# Altium project Motor Driver.PrjPcb
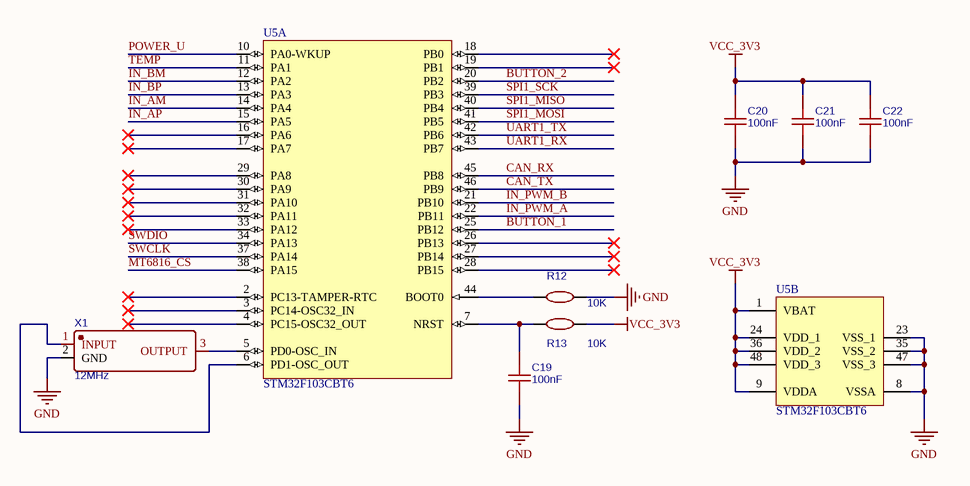
[diagram p0: MCU.SchDoc]
2 sheets, 18 parts. Net scope: global (net labels, ports and power ports of the same name join across sheets).
Board file: Motor Driver.PcbDoc
Sheets:
  MCU.SchDoc
  Port.SchDoc

## Sheet MCU.SchDoc
size 228 x 127 mm; SheetNumber: 3; SheetTotal: 5

### Parts
C19  100nF  [C0603]
C20  100nF  [C0603]
C21  100nF  [C0603]
C22  100nF  [C0603]
R12  10K  [R0603]
R13  10K  [R0603]
U5  STM32F103CBT6  [STM-LQFP48_L]  (parts A,B of 2)
X1  12MHz  [CRYSTAL-SMD_3P-L3.2-W1.3-P1.2-BL]

### Nets
GND: C19.1 C20.1 C21.1 C22.1 R12.2 U5.8(VSSA) U5.23(VSS_1) U5.35(VSS_2) U5.47(VSS_3) X1.2(GND)
VCC_3V3: C20.2 C21.2 C22.2 R13.2 U5.1(VBAT) U5.9(VDDA) U5.24(VDD_1) U5.36(VDD_2) U5.48(VDD_3)
BUTTON_1: U5.25(PB12)
BUTTON_2: U5.20(PB2)
CAN_RX: U5.45(PB8)
CAN_TX: U5.46(PB9)
IN_AM: U5.14(PA4)
IN_AP: U5.15(PA5)
IN_BM: U5.12(PA2)
IN_BP: U5.13(PA3)
IN_PWM_A: U5.22(PB11)
IN_PWM_B: U5.21(PB10)
MT6816_CS: U5.38(PA15)
POWER_U: U5.10(PA0-WKUP)
SPI1_MISO: U5.40(PB4)
SPI1_MOSI: U5.41(PB5)
SPI1_SCK: U5.39(PB3)
SWCLK: U5.37(PA14)
SWDIO: U5.34(PA13)
TEMP: U5.11(PA1)
UART1_RX: U5.43(PB7)
UART1_TX: U5.42(PB6)
NetC19_2: C19.2 R13.1 U5.7(NRST)
NetR12_1: R12.1 U5.44(BOOT0)
NetU5_5: U5.5(PD0-OSC_IN) X1.3(OUTPUT)
NetU5_6: U5.6(PD1-OSC_OUT) X1.1(INPUT)

Not connected (* = marked no-connect by the designer): U5 2(PC13-TAMPER-RTC)* 3(PC14-OSC32_IN)* 4(PC15-OSC32_OUT)* 16(PA6)* 17(PA7)* 18(PB0)* 19(PB1)* 26(PB13)* 27(PB14)* 28(PB15)* 29(PA8)* 30(PA9)* 31(PA10)* 32(PA11)* 33(PA12)*

### Library data of the parts
C19-C22 = 100nF: BOM_Manufacturer: SAMSUNG; BOM_Manufacturer Part: CL10B104KB8NNNC; nameAlias: Capacitance; BOM_Supplier: LCSC; BOM_Supplier Part: C1591; BOM_JLCPCB Part Class: Extended Part; spicePre: C; spiceSymbolName: CL10B104KB8NNNC
R12 R13 = 10K: BOM_Manufacturer: UniOhm; BOM_Manufacturer Part: 0603WAF1002T5E; nameAlias: Resistance (Ohms); BOM_Supplier: LCSC; BOM_Supplier Part: C25804; BOM_JLCPCB Part Class: Basic Part; spicePre: R; spiceSymbolName: 0603WAF1002T5E
U5 = CMP-0237-00250-3: ARM Cortex-M3 32-bit MCU, 128 KB Flash, 20 KB Internal RAM, 37 I/Os, 48-pin LQFP, -40 to 85 degC, Tray; Supply Voltage(Vcc) min (V): 2; Operating Frequency(F) (Processor speed) (MHz): 72; A/D Converter: 2x12-bit (10 Channel); FLASH Size (Prog) (kB): 128; Internal RAM Size (kB): 20; I/Os (High Current): 37; ComponentLink2Description: Datasheet; PackageReference: LQFP48; PartNumber: STM32F103CBT6; ComponentLink1Description: Manufacturer URL; DatasheetVersion: Rev. 16; PackageVersion: Rev. 6, 06/2013; Packing: Tray; ComponentLink1URL: http://www.st.com/web/en/home.html; Mounting Technology: Surface Mount; ComponentLink3URL: http://www.st.com/st-web-ui/static/active/en/resource/technical/document/datasheet/DM00058181.pdf; PackageDescription: 48-Pin Low Profile Quad Flat Package, 7 x 7 mm Body, 0.5 mm Pitch; Core: ARM Cortex-M3; ComponentLink3Description: Package Specification; ComponentLink2URL: http://www.st.com/st-web-ui/static/active/en/resource/technical/document/datasheet/CD00161566.pdf
X1 = 12MHz: BOM_Manufacturer: muRata(村田); BOM_Manufacturer Part: CSTNE12M0G52A000R0; nameAlias: Frequency; Contributor: LCSC; BOM_Supplier: LCSC; BOM_Supplier Part: C907957; BOM_JLCPCB Part Class: Extended Part; spicePre: X; spiceSymbolName: CSTNE12M0G52A000R0

## Sheet Port.SchDoc
size 127 x 177 mm; SheetNumber: 4; SheetTotal: 5
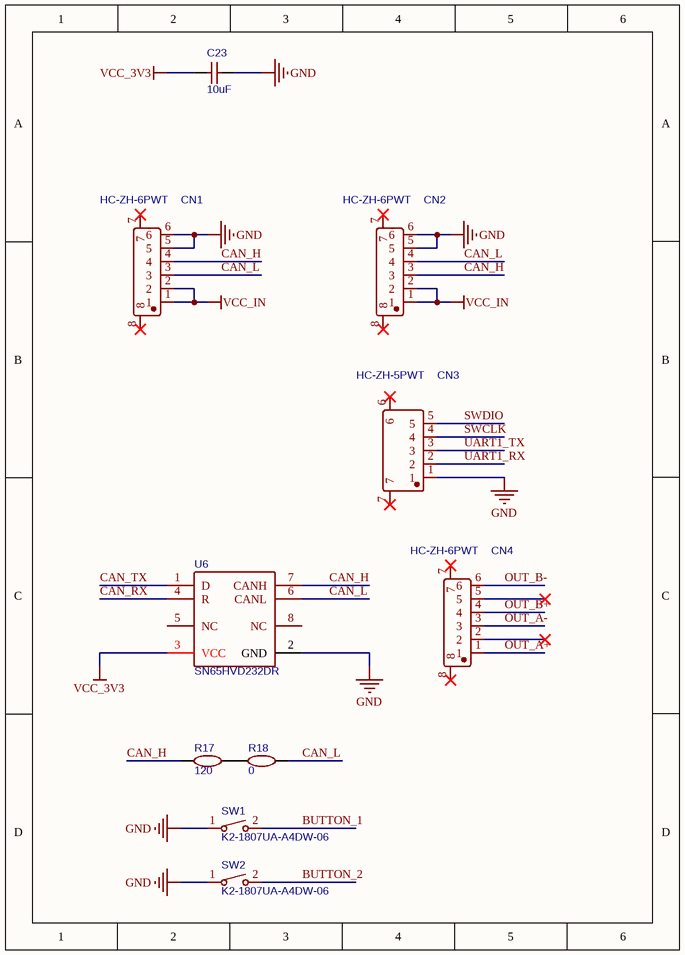
[diagram p1: Port.SchDoc]

### Parts
C23  10uF  [C1206]
CN1  HC-ZH-6PWT  [CONN-SMD_6P-P1.50_HCTL_HC-ZH-6PWT]
CN2  HC-ZH-6PWT  [CONN-SMD_6P-P1.50_HCTL_HC-ZH-6PWT]
CN3  HC-ZH-5PWT  [CONN-SMD_5P-P1.50_HCTL_HC-ZH-5PWT]
CN4  HC-ZH-6PWT  [CONN-SMD_6P-P1.50_HCTL_HC-ZH-6PWT]
R17  120  [R0603]
R18  0  [R0805]
SW1  K2-1807UA-A4DW-06  [KEY-SMD_L4.0-W2.9-L]
SW2  K2-1807UA-A4DW-06  [KEY-SMD_L4.0-W2.9-L]
U6  SN65HVD232DR  [SOIC-8_L5.0-W4.0-P1.27-LS6.0-BL]

### Nets
GND: C23.2 CN1.5 CN1.6 CN2.5 CN2.6 CN3.1 SW1.1 SW2.1 U6.2(GND)
VCC_3V3: C23.1 U6.3(VCC)
VCC_IN: CN1.1 CN1.2 CN2.1 CN2.2
BUTTON_1: SW1.2
BUTTON_2: SW2.2
CAN_H: CN1.4 CN2.3 R17.1 U6.7(CANH)
CAN_L: CN1.3 CN2.4 R18.2 U6.6(CANL)
CAN_RX: U6.4(R)
CAN_TX: U6.1(D)
OUT_A+: CN4.1
OUT_A-: CN4.3
OUT_B+: CN4.4
OUT_B-: CN4.6
SWCLK: CN3.4
SWDIO: CN3.5
UART1_RX: CN3.2
UART1_TX: CN3.3
NetR17_2: R17.2 R18.1

Not connected (* = marked no-connect by the designer): CN1 7* 8*; CN2 7* 8*; CN3 6* 7*; CN4 2* 5* 7* 8*; U6 5(NC) 8(NC)

### Library data of the parts
C23 = 10uF: BOM_Manufacturer Part: CL31A106KBHNNNE; BOM_Manufacturer: SAMSUNG; nameAlias: Capacitance; BOM_Supplier: LCSC; BOM_Supplier Part: C13585; BOM_JLCPCB Part Class: Basic Part; spicePre: C; spiceSymbolName: CL31A106KBHNNNE
CN1 CN2 CN4 = HC-ZH-6PWT: BOM_Manufacturer: HCTL(华灿天禄); Contributor: LCSC; BOM_Supplier: LCSC; BOM_Supplier Part: C2845428; BOM_Manufacturer Part: HC-ZH-6PWT; spicePre: C; spiceSymbolName: HC-ZH-6PWT
CN3 = HC-ZH-5PWT: BOM_Manufacturer: HCTL(华灿天禄); Contributor: LCSC; BOM_Supplier: LCSC; BOM_Supplier Part: C2845427; BOM_Manufacturer Part: HC-ZH-5PWT; spicePre: C; spiceSymbolName: HC-ZH-5PWT
R17 = 120: BOM_Manufacturer: UniOhm; BOM_Manufacturer Part: 0603WAF1200T5E; nameAlias: Resistance (Ohms); BOM_Supplier: LCSC; BOM_Supplier Part: C22787; BOM_JLCPCB Part Class: Basic Part; spicePre: R; spiceSymbolName: 0603WAF1200T5E
R18 = 0: BOM_Manufacturer: WTC; BOM_Manufacturer Part: WR08X000PTL; nameAlias: Resistance (Ohms); BOM_Supplier: LCSC; BOM_Supplier Part: C112378; BOM_JLCPCB Part Class: Extended Part; spicePre: R; spiceSymbolName: WR08X000PTL
SW1 SW2 = K2-1807UA-A4DW-06: BOM_Manufacturer: Korean Hroparts Elec; Contributor: LCSC; BOM_Supplier: LCSC; BOM_Supplier Part: C502307; BOM_Manufacturer Part: K2-1807UA-A4DW-06; BOM_JLCPCB Part Class: Extended Part; spicePre: S; spiceSymbolName: K2-1807UA-A4DW-06
U6 = SN65HVD232DR: BOM_Manufacturer: TI; BOM_Supplier: LCSC; BOM_Manufacturer Part: SN65HVD232DR; BOM_Supplier Part: C30530; BOM_JLCPCB Part Class: Extended Part; spicePre: U; spiceSymbolName: SN65HVD232DR

## Nets that join several sheets
GND: MCU (10 pins), Port (9 pins)
VCC_3V3: MCU (9 pins), Port (C23.1 U6.3)
BUTTON_1: MCU (U5.25), Port (SW1.2)
BUTTON_2: MCU (U5.20), Port (SW2.2)
CAN_RX: MCU (U5.45), Port (U6.4)
CAN_TX: MCU (U5.46), Port (U6.1)
SWCLK: MCU (U5.37), Port (CN3.4)
SWDIO: MCU (U5.34), Port (CN3.5)
UART1_RX: MCU (U5.43), Port (CN3.2)
UART1_TX: MCU (U5.42), Port (CN3.3)